# EAGLE schematic needles_2.5 (EAGLE 8.6.0)

## Sheet 1 of 2
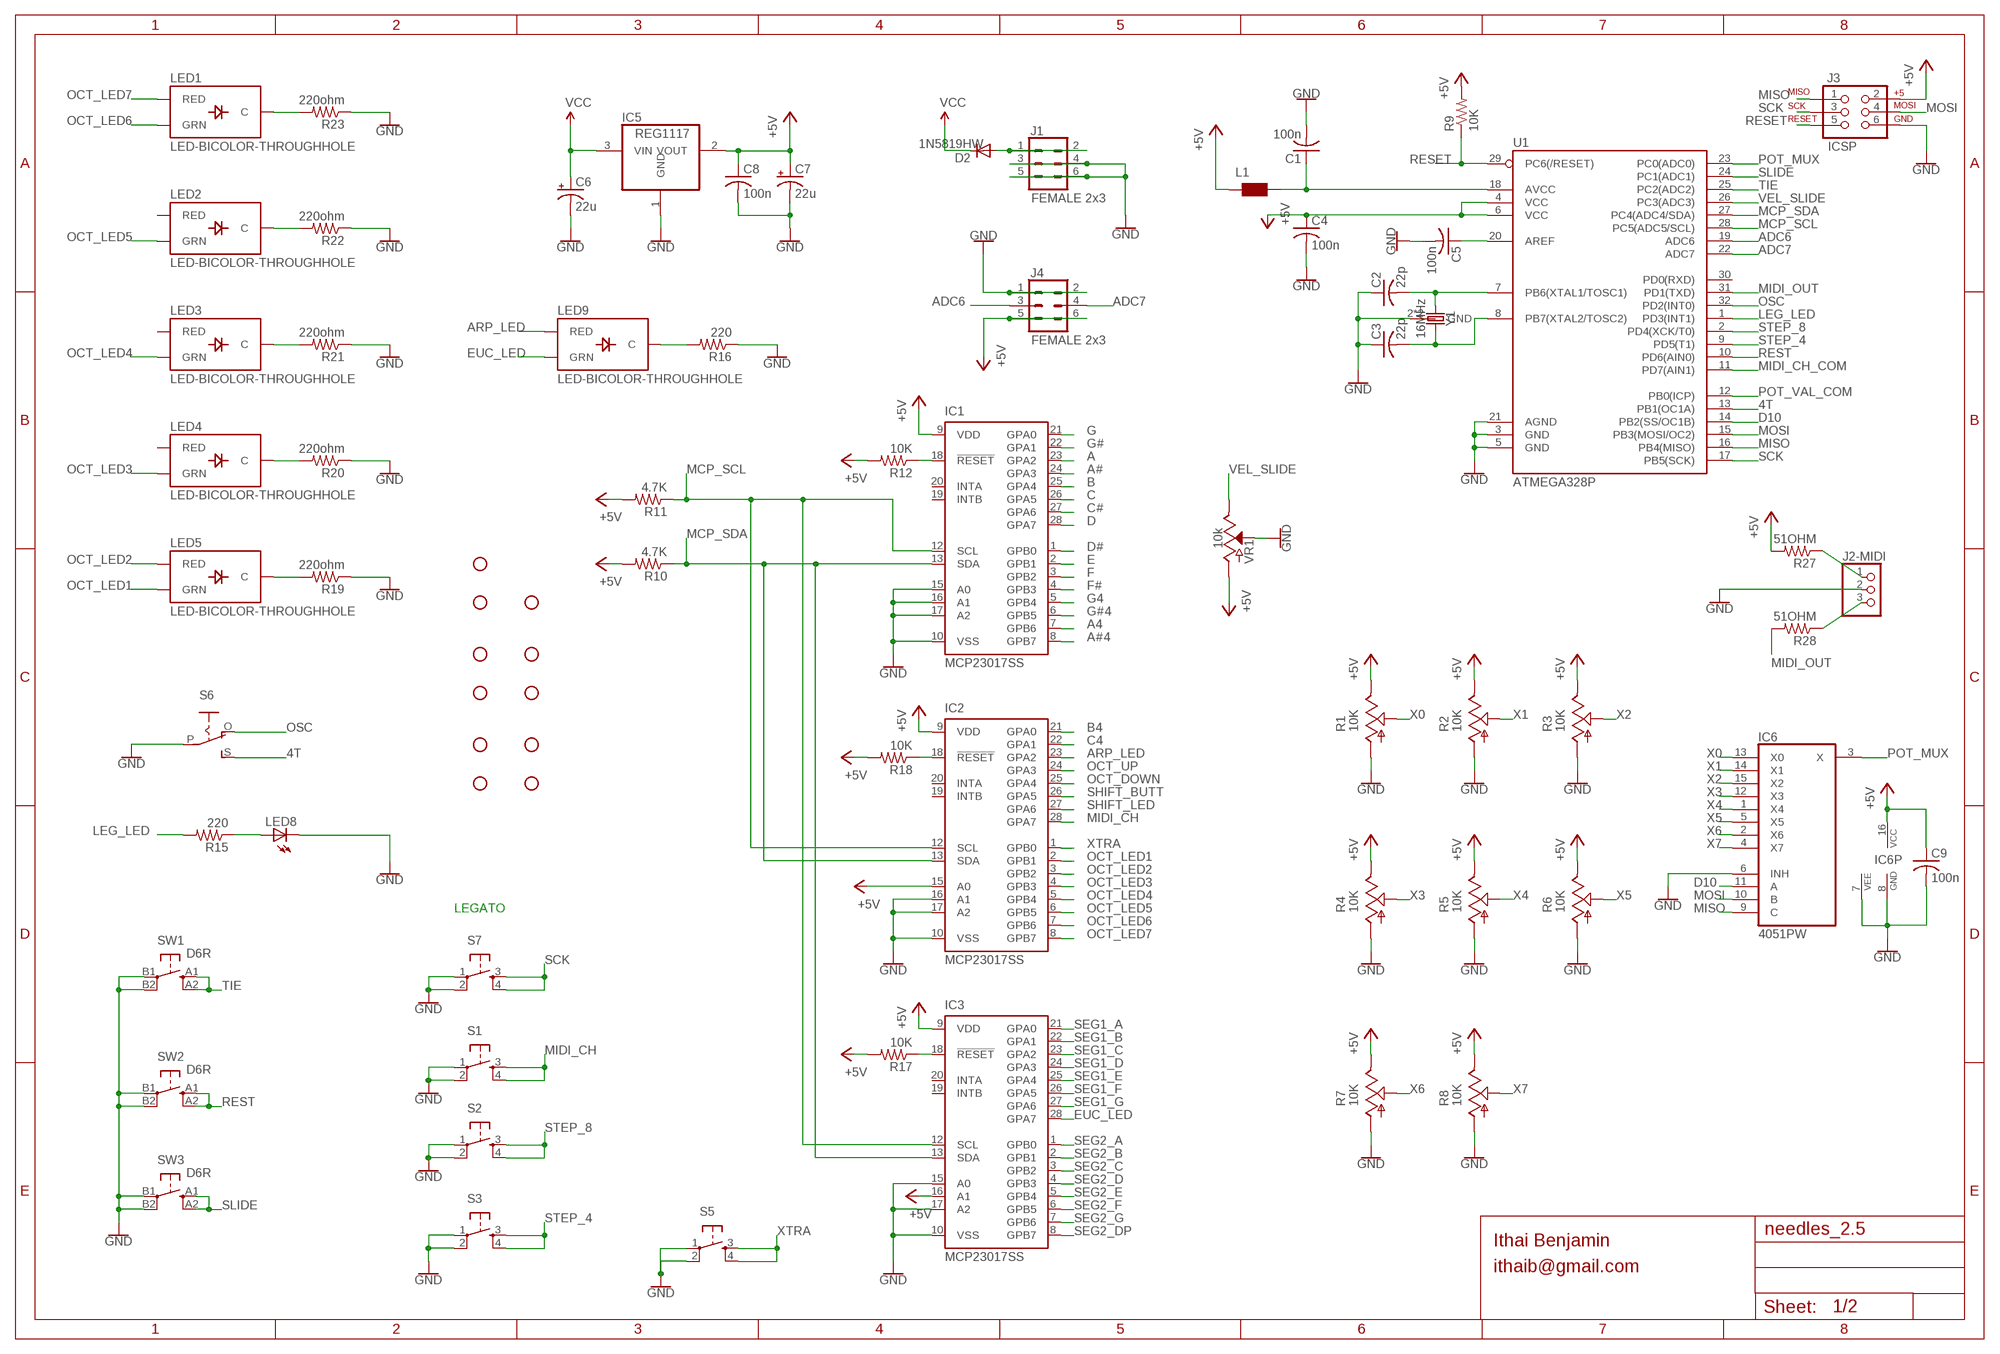
[diagram p0: schematic, sheet 1]

### Parts
C1  100n  C-USC0603  [C0603]
C2  22p  C-USC0603  [C0603]
C3  22p  C-USC0603  [C0603]
C4  100n  C-USC0603  [C0603]
C5  100n  C-USC0603  [C0603]
C6  22u  CPOL-USC  [PANASONIC_C]
C7  22u  CPOL-USC  [PANASONIC_C]
C8  100n  C-USC0603  [C0603]
C9  100n  C-USC0603  [C0603]
D2  1N5819HW  DIODE-SOD123  [SOD123]
H1  STAND-OFF  [STAND-OFF]
H2  STAND-OFF  [STAND-OFF]
H3  STAND-OFF  [STAND-OFF]
H4  STAND-OFF  [STAND-OFF]
H5  STAND-OFF  [STAND-OFF]
H6  STAND-OFF  [STAND-OFF]
H7  STAND-OFF  [STAND-OFF]
H8  STAND-OFF  [STAND-OFF]
H9  STAND-OFF  [STAND-OFF]
H10  STAND-OFF  [STAND-OFF]
H11  STAND-OFF  [STAND-OFF]
IC1  MCP23017SS  [SSOP28]
IC2  MCP23017SS  [SSOP28]
IC3  MCP23017SS  [SSOP28]
IC5  REG1117  [SOT223]
IC6  4051PW  [TSSOP16]
J1  FEMALE 2x3  CONN_03X2FEMALE  [2X3]
J2-MIDI  PINHD-1X3  [1X03]
J3  ICSP  AVR_SPI_PRG_6PTH  [2X3]
J4  FEMALE 2x3  CONN_03X2FEMALE  [2X3]
L1  WE-CBF_0603  [0603]
LED1  LED-BICOLOR-THROUGHHOLE  [LED-BICOLOR-THROUGHHOLE]
LED2  LED-BICOLOR-THROUGHHOLE  [LED-BICOLOR-THROUGHHOLE]
LED3  LED-BICOLOR-THROUGHHOLE  [LED-BICOLOR-THROUGHHOLE]
LED4  LED-BICOLOR-THROUGHHOLE  [LED-BICOLOR-THROUGHHOLE]
LED5  LED-BICOLOR-THROUGHHOLE  [LED-BICOLOR-THROUGHHOLE]
LED8  LED3MM  [LED3MM]
LED9  LED-BICOLOR-THROUGHHOLE  [LED-BICOLOR-THROUGHHOLE]
R1  10K  POT_USVERTICAL  [ALPS_POT_VERTICAL]
R2  10K  POT_USVERTICAL  [ALPS_POT_VERTICAL]
R3  10K  POT_USVERTICAL  [ALPS_POT_VERTICAL]
R4  10K  POT_USVERTICAL  [ALPS_POT_VERTICAL]
R5  10K  POT_USVERTICAL  [ALPS_POT_VERTICAL]
R6  10K  POT_USVERTICAL  [ALPS_POT_VERTICAL]
R7  10K  POT_USVERTICAL  [ALPS_POT_VERTICAL]
R8  10K  POT_USVERTICAL  [ALPS_POT_VERTICAL]
R9  10K  R-US_R0603  [R0603]
R10  4.7K  R-US_R0603  [R0603]
R11  4.7K  R-US_R0603  [R0603]
R12  10K  R-US_R0603  [R0603]
R15  220  R-US_R0603  [R0603]
R16  220  R-US_R0603  [R0603]
R17  10K  R-US_R0603  [R0603]
R18  10K  R-US_R0603  [R0603]
R19  220ohm  R-US_R0603  [R0603]
R20  220ohm  R-US_R0603  [R0603]
R21  220ohm  R-US_R0603  [R0603]
R22  220ohm  R-US_R0603  [R0603]
R23  220ohm  R-US_R0603  [R0603]
R27  51OHM  R-US_R0603  [R0603]
R28  51OHM  R-US_R0603  [R0603]
S1  TAC_SWITCHPTH  [TACTILE-PTH]
S2  TAC_SWITCHPTH  [TACTILE-PTH]
S3  TAC_SWITCHPTH  [TACTILE-PTH]
S5  TAC_SWITCHPTH  [TACTILE-PTH]
S6  S-ON-ONSMALL_SLIDE  [ES_100SP1T6B11M2QEH_SMALL]
S7  TAC_SWITCHPTH  [TACTILE-PTH]
SW1  D6R  [D6R]
SW2  D6R  [D6R]
SW3  D6R  [D6R]
U1  ATMEGA328P  ATMEGA328P_TQFP  [TQFP32-08]
VR1  10k  POTENTIOMETER_SLIDE-30MM-1/10W-20%  [SLIDER-MEDIUM]
Y1  16MHz  CRYSTAL-16MHZSMD-5X3.2  [CRYSTAL-SMD-5X3.2-4PAD]

### Nets
4T: S6.S U1.13(PB1(OC1A))
+5V: C4.1 C7.+ C8.1 C9.1 IC1.9(VDD) IC2.9(VDD) IC2.15(A0) IC3.9(VDD) IC3.16(A1) IC5.2(VOUT) IC6.16(VCC) J3.2 J4.5 J4.6 L1.1 R1.P$1(E) R2.P$1(E) R3.P$1(E) R4.P$1(E) R5.P$1(E) R6.P$1(E) R7.P$1(E) R8.P$1(E) R9.2 R10.2 R11.2 R12.2 R17.2 R18.2 R27.2 U1.4(VCC) U1.6(VCC) VR1.BOTTOM(A) ; also sheet 2
A: IC1.23(GPA2) ; also sheet 2
A4: IC1.7(GPB6) ; also sheet 2
A#: IC1.24(GPA3) ; also sheet 2
A#4: IC1.8(GPB7) ; also sheet 2
ADC6: J4.3 U1.19(ADC6)
ADC7: J4.4 U1.22(ADC7)
AREF: C5.1 U1.20(AREF)
ARP_LED: IC2.23(GPA2) LED9.3(RED)
B: IC1.25(GPA4) ; also sheet 2
B4: IC2.21(GPA0) ; also sheet 2
C: IC1.26(GPA5) ; also sheet 2
C4: IC2.22(GPA1) ; also sheet 2
C#: IC1.27(GPA6) ; also sheet 2
D: IC1.28(GPA7) ; also sheet 2
D10: IC6.11(A) U1.14(PB2(SS/OC1B))
D#: IC1.1(GPB0) ; also sheet 2
E: IC1.2(GPB1) ; also sheet 2
EUC_LED: IC3.28(GPA7) LED9.1(GRN)
F: IC1.3(GPB2) ; also sheet 2
F#: IC1.4(GPB3) ; also sheet 2
G: IC1.21(GPA0) ; also sheet 2
G4: IC1.5(GPB4) ; also sheet 2
G#: IC1.22(GPA1) ; also sheet 2
G#4: IC1.6(GPB5) ; also sheet 2
GND: C1.2 C2.1 C3.1 C4.2 C5.2 C6.- C7.- C8.2 C9.2 IC1.10(VSS) IC1.15(A0) IC1.16(A1) IC1.17(A2) IC2.10(VSS) IC2.16(A1) IC2.17(A2) IC3.10(VSS) IC3.15(A0) IC3.17(A2) IC5.1(GND) IC6.6(INH) IC6.7(VEE) IC6.8(GND) J1.3 J1.4 J1.5 J1.6 J2-MIDI.2 J3.6 J4.1 J4.2 LED8.K(C) R1.P$3(A) R2.P$3(A) R3.P$3(A) R4.P$3(A) R5.P$3(A) R6.P$3(A) R7.P$3(A) R8.P$3(A) R16.1 R19.1 R20.1 R21.1 R22.1 R23.1 S1.1 S1.2 S2.1 S2.2 S3.1 S3.2 S5.1 S5.2 S6.P S7.1 S7.2 SW1.B1(P) SW1.B2(P1) SW2.B1(P) SW2.B2(P1) SW3.B1(P) SW3.B2(P1) U1.3(GND) U1.5(GND) U1.21(AGND) VR1.WIPER(S) Y1.2(GND) Y1.4(GND) ; also sheet 2
LEG_LED: R15.2 U1.1(PD3(INT1))
MCP_SCL: IC1.12(SCL) IC2.12(SCL) IC3.12(SCL) R11.1 U1.28(PC5(ADC5/SCL))
MCP_SDA: IC1.13(SDA) IC2.13(SDA) IC3.13(SDA) R10.1 U1.27(PC4(ADC4/SDA))
MIDI_CH: IC2.28(GPA7) S1.3 S1.4
MIDI_CH_COM: U1.11(PD7(AIN1)) ; also sheet 2
MIDI_OUT: R28.2 U1.31(PD1(TXD))
MISO: IC6.9(C) J3.1 U1.16(PB4(MISO))
MOSI: IC6.10(B) J3.4 U1.15(PB3(MOSI/OC2))
N$1: IC1.18(!RESET) R12.1
N$2: IC2.18(!RESET) R18.1
N$3: C1.1 L1.2 U1.18(AVCC)
N$4: LED1.2(C) R23.2
N$5: C2.2 U1.7(PB6(XTAL1/TOSC1)) Y1.1
N$6: C3.2 U1.8(PB7(XTAL2/TOSC2)) Y1.3
N$7: LED2.2(C) R22.2
N$8: IC3.18(!RESET) R17.1
N$9: LED3.2(C) R21.2
N$10: LED4.2(C) R20.2
N$11: LED5.2(C) R19.2
N$13: J2-MIDI.1 R27.1
N$18: J2-MIDI.3 R28.1
N$21: LED8.A R15.1
N$23: LED9.2(C) R16.2
N$42: D2.A J1.1 J1.2
OCT_DOWN: IC2.25(GPA4) ; also sheet 2
OCT_LED1: IC2.2(GPB1) LED5.1(GRN)
OCT_LED2: IC2.3(GPB2) LED5.3(RED)
OCT_LED3: IC2.4(GPB3) LED4.1(GRN)
OCT_LED4: IC2.5(GPB4) LED3.1(GRN)
OCT_LED5: IC2.6(GPB5) LED2.1(GRN)
OCT_LED6: IC2.7(GPB6) LED1.1(GRN)
OCT_LED7: IC2.8(GPB7) LED1.3(RED)
OCT_UP: IC2.24(GPA3) ; also sheet 2
OSC: S6.O U1.32(PD2(INT0))
POT_MUX: IC6.3(X) U1.23(PC0(ADC0))
POT_VAL_COM: U1.12(PB0(ICP)) ; also sheet 2
RESET: J3.5 R9.1 U1.29(PC6(/RESET))
REST: SW2.A1(S) SW2.A2(S1) U1.10(PD6(AIN0))
SCK: J3.3 S7.3 S7.4 U1.17(PB5(SCK))
SEG1_A: IC3.21(GPA0) ; also sheet 2
SEG1_B: IC3.22(GPA1) ; also sheet 2
SEG1_C: IC3.23(GPA2) ; also sheet 2
SEG1_D: IC3.24(GPA3) ; also sheet 2
SEG1_E: IC3.25(GPA4) ; also sheet 2
SEG1_F: IC3.26(GPA5) ; also sheet 2
SEG1_G: IC3.27(GPA6) ; also sheet 2
SEG2_A: IC3.1(GPB0) ; also sheet 2
SEG2_B: IC3.2(GPB1) ; also sheet 2
SEG2_C: IC3.3(GPB2) ; also sheet 2
SEG2_D: IC3.4(GPB3) ; also sheet 2
SEG2_DP: IC3.8(GPB7) ; also sheet 2
SEG2_E: IC3.5(GPB4) ; also sheet 2
SEG2_F: IC3.6(GPB5) ; also sheet 2
SEG2_G: IC3.7(GPB6) ; also sheet 2
SHIFT_BUTT: IC2.26(GPA5) ; also sheet 2
SHIFT_LED: IC2.27(GPA6) ; also sheet 2
SLIDE: SW3.A1(S) SW3.A2(S1) U1.24(PC1(ADC1))
STEP_4: S3.3 S3.4 U1.9(PD5(T1))
STEP_8: S2.3 S2.4 U1.2(PD4(XCK/T0))
TIE: SW1.A1(S) SW1.A2(S1) U1.25(PC2(ADC2))
VCC: C6.+ D2.C IC5.3(VIN)
VEL_SLIDE: U1.26(PC3(ADC3)) VR1.TOP(E)
X0: IC6.13(X0) R1.P$2(S)
X1: IC6.14(X1) R2.P$2(S)
X2: IC6.15(X2) R3.P$2(S)
X3: IC6.12(X3) R4.P$2(S)
X4: IC6.1(X4) R5.P$2(S)
X5: IC6.5(X5) R6.P$2(S)
X6: IC6.2(X6) R7.P$2(S)
X7: IC6.4(X7) R8.P$2(S)
XTRA: IC2.1(GPB0) S5.3 S5.4
Unconnected: IC1.19(INTB) IC1.20(INTA) IC2.19(INTB) IC2.20(INTA) IC3.19(INTB) IC3.20(INTA) LED2.3(RED) LED3.3(RED) LED4.3(RED) U1.30(PD0(RXD))

### Notes on the sheet
- LEGATO
- Ithai Benjamin
- ithaib@gmail.com

## Sheet 2 of 2
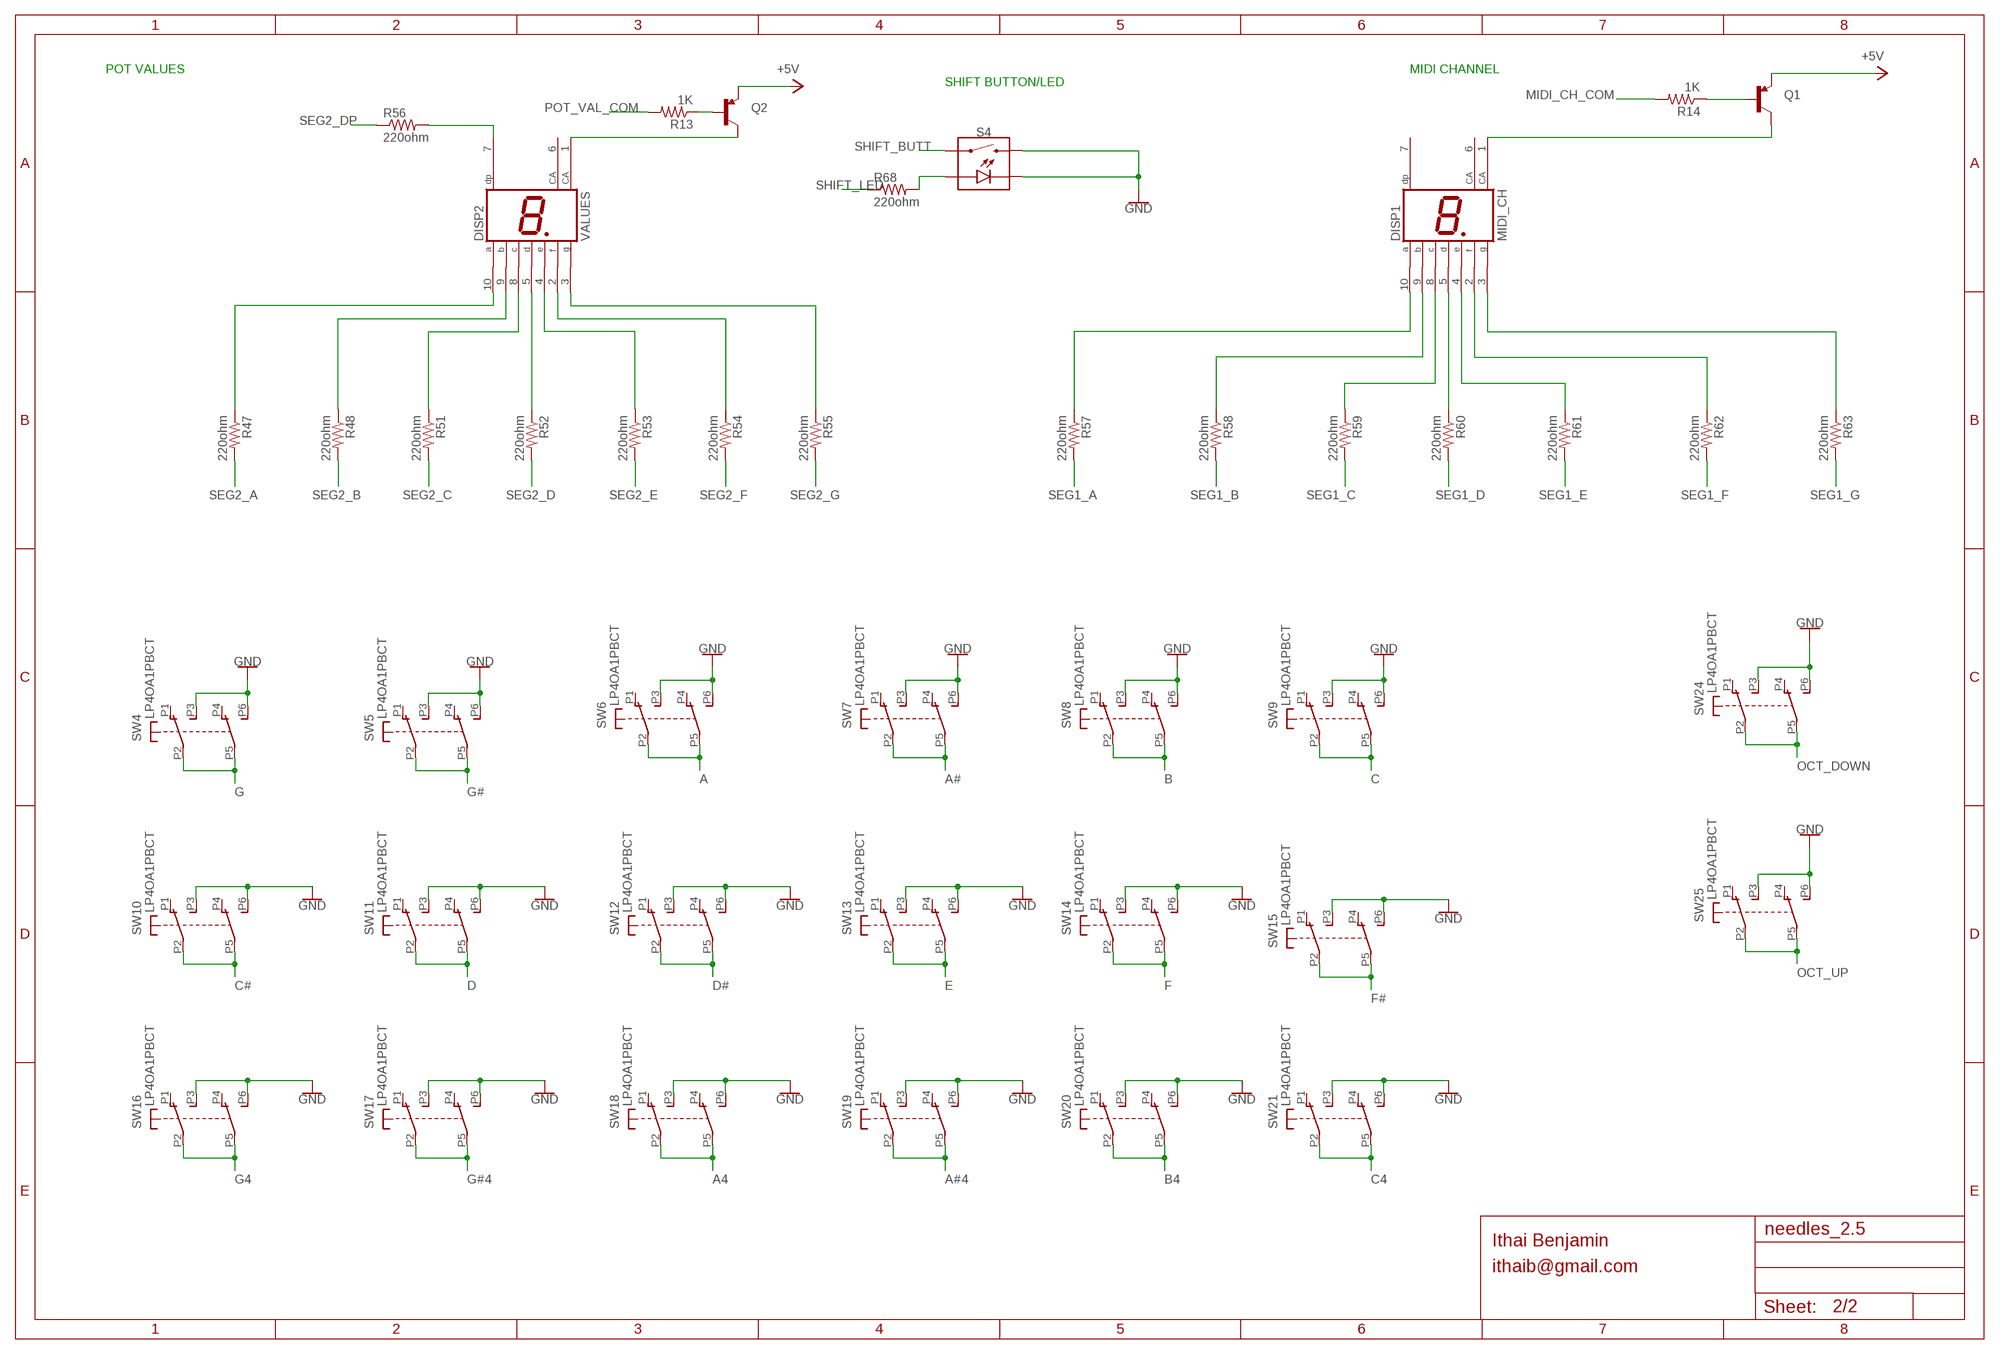
[diagram p1: schematic, sheet 2]

### Parts
DISP1  MIDI_CH  DISPLAY-HP_HD-F101  [DISPLAY-HP_HDSP-E]
DISP2  VALUES  DISPLAY-HP_HD-F101  [DISPLAY-HP_HDSP-E]
Q1  TRANSISTOR_PNPSMD  [SOT23-3]
Q2  TRANSISTOR_PNPSMD  [SOT23-3]
R13  1K  R-US_R0603  [R0603]
R14  1K  R-US_R0603  [R0603]
R47  220ohm  R-US_R0603  [R0603]
R48  220ohm  R-US_R0603  [R0603]
R51  220ohm  R-US_R0603  [R0603]
R52  220ohm  R-US_R0603  [R0603]
R53  220ohm  R-US_R0603  [R0603]
R54  220ohm  R-US_R0603  [R0603]
R55  220ohm  R-US_R0603  [R0603]
R56  220ohm  R-US_R0603  [R0603]
R57  220ohm  R-US_R0603  [R0603]
R58  220ohm  R-US_R0603  [R0603]
R59  220ohm  R-US_R0603  [R0603]
R60  220ohm  R-US_R0603  [R0603]
R61  220ohm  R-US_R0603  [R0603]
R62  220ohm  R-US_R0603  [R0603]
R63  220ohm  R-US_R0603  [R0603]
R68  220ohm  R-US_R0603  [R0603]
S4  MOMENTARY-SWITCH-SPST-LED-PTH-12MM  [TACTILE_SWITCH_LED_PTH_12MM]
SW4  LP4OA1PBCT  [LP4OA1PBCT]
SW5  LP4OA1PBCT  [LP4OA1PBCT]
SW6  LP4OA1PBCT  [LP4OA1PBCT]
SW7  LP4OA1PBCT  [LP4OA1PBCT]
SW8  LP4OA1PBCT  [LP4OA1PBCT]
SW9  LP4OA1PBCT  [LP4OA1PBCT]
SW10  LP4OA1PBCT  [LP4OA1PBCT]
SW11  LP4OA1PBCT  [LP4OA1PBCT]
SW12  LP4OA1PBCT  [LP4OA1PBCT]
SW13  LP4OA1PBCT  [LP4OA1PBCT]
SW14  LP4OA1PBCT  [LP4OA1PBCT]
SW15  LP4OA1PBCT  [LP4OA1PBCT]
SW16  LP4OA1PBCT  [LP4OA1PBCT]
SW17  LP4OA1PBCT  [LP4OA1PBCT]
SW18  LP4OA1PBCT  [LP4OA1PBCT]
SW19  LP4OA1PBCT  [LP4OA1PBCT]
SW20  LP4OA1PBCT  [LP4OA1PBCT]
SW21  LP4OA1PBCT  [LP4OA1PBCT]
SW24  LP4OA1PBCT  [LP4OA1PBCT]
SW25  LP4OA1PBCT  [LP4OA1PBCT]

### Nets
+5V: Q1.2(E) Q2.2(E) ; also sheet 1
A: SW6.P2(A2) SW6.P5(B2) ; also sheet 1
A4: SW18.P2(A2) SW18.P5(B2) ; also sheet 1
A#: SW7.P2(A2) SW7.P5(B2) ; also sheet 1
A#4: SW19.P2(A2) SW19.P5(B2) ; also sheet 1
B: SW8.P2(A2) SW8.P5(B2) ; also sheet 1
B4: SW20.P2(A2) SW20.P5(B2) ; also sheet 1
C: SW9.P2(A2) SW9.P5(B2) ; also sheet 1
C4: SW21.P2(A2) SW21.P5(B2) ; also sheet 1
C#: SW10.P2(A2) SW10.P5(B2) ; also sheet 1
D: SW11.P2(A2) SW11.P5(B2) ; also sheet 1
D#: SW12.P2(A2) SW12.P5(B2) ; also sheet 1
E: SW13.P2(A2) SW13.P5(B2) ; also sheet 1
F: SW14.P2(A2) SW14.P5(B2) ; also sheet 1
F#: SW15.P2(A2) SW15.P5(B2) ; also sheet 1
G: SW4.P2(A2) SW4.P5(B2) ; also sheet 1
G4: SW16.P2(A2) SW16.P5(B2) ; also sheet 1
G#: SW5.P2(A2) SW5.P5(B2) ; also sheet 1
G#4: SW17.P2(A2) SW17.P5(B2) ; also sheet 1
GND: S4.1 S4.2 S4.C SW4.P3(A3) SW4.P6(B3) SW5.P3(A3) SW5.P6(B3) SW6.P3(A3) SW6.P6(B3) SW7.P3(A3) SW7.P6(B3) SW8.P3(A3) SW8.P6(B3) SW9.P3(A3) SW9.P6(B3) SW10.P3(A3) SW10.P6(B3) SW11.P3(A3) SW11.P6(B3) SW12.P3(A3) SW12.P6(B3) SW13.P3(A3) SW13.P6(B3) SW14.P3(A3) SW14.P6(B3) SW15.P3(A3) SW15.P6(B3) SW16.P3(A3) SW16.P6(B3) SW17.P3(A3) SW17.P6(B3) SW18.P3(A3) SW18.P6(B3) SW19.P3(A3) SW19.P6(B3) SW20.P3(A3) SW20.P6(B3) SW21.P3(A3) SW21.P6(B3) SW24.P3(A3) SW24.P6(B3) SW25.P3(A3) SW25.P6(B3) ; also sheet 1
MIDI_CH_COM: R14.2 ; also sheet 1
N$12: R68.2 S4.A
N$17: Q1.1(B) R14.1
N$20: Q2.1(B) R13.1
N$22: DISP2.1(CA) Q2.3(C)
N$29: DISP2.10(A) R47.1
N$30: DISP2.9(B) R48.1
N$31: DISP2.8(C) R51.1
N$32: DISP2.5(D) R52.1
N$33: DISP2.4(E) R53.1
N$34: DISP2.2(F) R54.1
N$35: DISP2.3(G) R55.1
N$36: DISP1.10(A) R57.1
N$37: DISP2.7(DP) R56.2
N$38: DISP1.1(CA) Q1.3(C)
N$39: DISP1.9(B) R58.1
N$40: DISP1.8(C) R59.1
N$41: DISP1.5(D) R60.1
N$43: DISP1.4(E) R61.1
N$44: DISP1.2(F) R62.1
N$45: DISP1.3(G) R63.1
OCT_DOWN: SW24.P2(A2) SW24.P5(B2) ; also sheet 1
OCT_UP: SW25.P2(A2) SW25.P5(B2) ; also sheet 1
POT_VAL_COM: R13.2 ; also sheet 1
SEG1_A: R57.2 ; also sheet 1
SEG1_B: R58.2 ; also sheet 1
SEG1_C: R59.2 ; also sheet 1
SEG1_D: R60.2 ; also sheet 1
SEG1_E: R61.2 ; also sheet 1
SEG1_F: R62.2 ; also sheet 1
SEG1_G: R63.2 ; also sheet 1
SEG2_A: R47.2 ; also sheet 1
SEG2_B: R48.2 ; also sheet 1
SEG2_C: R51.2 ; also sheet 1
SEG2_D: R52.2 ; also sheet 1
SEG2_DP: R56.1 ; also sheet 1
SEG2_E: R53.2 ; also sheet 1
SEG2_F: R54.2 ; also sheet 1
SEG2_G: R55.2 ; also sheet 1
SHIFT_BUTT: S4.3 S4.4 ; also sheet 1
SHIFT_LED: R68.1 ; also sheet 1
Unconnected: DISP1.6(CA) DISP1.7(DP) DISP2.6(CA) SW4.P1(A1) SW4.P4(B1) SW5.P1(A1) SW5.P4(B1) SW6.P1(A1) SW6.P4(B1) SW7.P1(A1) SW7.P4(B1) SW8.P1(A1) SW8.P4(B1) SW9.P1(A1) SW9.P4(B1) SW10.P1(A1) SW10.P4(B1) SW11.P1(A1) SW11.P4(B1) SW12.P1(A1) SW12.P4(B1) SW13.P1(A1) SW13.P4(B1) SW14.P1(A1) SW14.P4(B1) SW15.P1(A1) SW15.P4(B1) SW16.P1(A1) SW16.P4(B1) SW17.P1(A1) SW17.P4(B1) SW18.P1(A1) SW18.P4(B1) SW19.P1(A1) SW19.P4(B1) SW20.P1(A1) SW20.P4(B1) SW21.P1(A1) SW21.P4(B1) SW24.P1(A1) SW24.P4(B1) SW25.P1(A1) SW25.P4(B1)

### Notes on the sheet
- POT VALUES | MIDI CHANNEL
- SHIFT BUTTON/LED
- Ithai Benjamin
- ithaib@gmail.com

## Library data of the parts
C1-C5 C8 C9 = grids_v02:C-US: CAPACITOR, American symbol
C6 C7 = grids_v02:CPOL-US: POLARIZED CAPACITOR, American symbol
D2 = grids_v02:DIODE-: DIODE
DISP1 DISP2 = Benjamin_Controller_V2.1:DISPLAY-HP_HD-F101: LED DISPLAY 1-character 7 segment, decimal point right; OC_FARNELL: unknown; OC_NEWARK: unknown
H1-H11 = SparkFun-Hardware:STAND-OFF: Stand Off Drill holes for mechanically mounting via screws, standoffs, etc. Note: Use the keepout ring to avoid running the screw head into surrounding components. Variant Overviews STAND-OFF - Mechanical footprint for a #4 phillips button head screw. STAND-OFF-TIGHT - Mechanical footprint for a #4 phillips button head screw, Example SparkFun Products Screw - Phillips Head (1/4", 4-40, 10 pack) <https://www.sparkfun.com/products/10453> (PRT-10453) Screw - Phillips Head (1/2", 4-40, 10 pack) <https://www.sparkfun.com/products/10452> (PRT-10452) Screw - Phillips Head (3/4", 4-40, 10 pack) <https://www.sparkfun.com/products/10451> (PRT-10451) Screw - Phillips Head (1", 4-40, 10 pack) <https://www.sparkfun.com/products/10450> (PRT-10450)
IC1-IC3 = adafruit:MCP23017: http://ww1.microchip.com/downloads/en/DeviceDoc/21952a.pdf Source: http://ww1.microchip.com/downloads/en/DeviceDoc/21952a.pdf
IC5 = grids_v02:REG1117: 800mA and 1A Low Dropout (LDO) Positive Regulator 1.8V, 2.5V, 2.85V, 3.3V, 5V, and Adj
IC6 = elements_v02:4051: 8-channel ANALOG MULTIPLEXER
J1 J4 = SparkFun-Connectors:CONN_03X2: Multi connection point. Often used as Generic Header-pin footprint for 0.1 inch spaced/style header connections You can populate with any combo of single row headers, but if you'd like an exact match, check these: Header - 2x3 (Male, 0.1") <https://www.sparkfun.com/products/12807> (PRT-12807) Header - 2x3 (Female, 0.1") <https://www.sparkfun.com/products/13010> (PRT-13010) 2x3 Pin Shrouded Header <https://www.sparkfun.com/products/10877> (PRT-10877) On any of the 0.1 inch spaced packages, you can populate with these: Break Away Headers - Straight <https://www.sparkfun.com/products/116> (PRT-00116) Break Away Male Headers - Right Angle <https://www.sparkfun.com/products/553> (PRT-00553) Female Headers <https://www.sparkfun.com/products/115> (PRT-00115) Break Away Headers - Machine Pin <https://www.sparkfun.com/products/117> (PRT-00117) Break Away Female Headers - Swiss Machine Pin <https://www.sparkfun.com/products/743> (PRT-00743) Special note: the shrouded connector mates well with our 3x2 ribbon cables: Ribbon Crimp Connector - 6-pin (2x3, Female) <https://www.sparkfun.com/products/10651> (PRT-10651) Ribbon Cable - 6 wire (15ft) <https://www.sparkfun.com/products/10646> (PRT-10646); PROD_ID: CONN-11566
J2-MIDI = adafruit:PINHD-1X3: PIN HEADER
J3 = grids_v02:AVR_SPI_PRG_6: AVR ISP 6 Pin This is the reduced ISP connector for AVR programming. Common on Arduino. This footprint will take up less PCB space and can be used with a 10-pin to 6-pin adapter such as SKU: BOB-08508
L1 = grids_v02:WE-CBF: SMD EMI Suppression Ferrite Beads - excellent anti-EMI properties - low DCR - impedances till 3000 ohms - rated current up to 6 A
LED1-LED5 LED9 = rings_v30:LED-BICOLOR-THROUGHHOLE
LED8 = grids_v02:LED: LED OSRAM: - CHIPLED LG R971, LG N971, LY N971, LG Q971, LY Q971, LO R971, LY R971 LH N974, LH R974 LS Q976, LO Q976, LY Q976 LO Q996 - Hyper CHIPLED LW Q18S LB Q993, LB Q99A, LB R99A - SideLED LS A670, LO A670, LY A670, LG A670, LP A670 LB A673, LV A673, LT A673, LW A673 LH A674 LY A675 LS A676, LA A676, LO A676, LY A676, LW A676 LS A679, LY A679, LG A679 - Hyper Micro SIDELED® LS Y876, LA Y876, LO Y876, LY Y876 LT Y87S - SmartLED LW L88C, LW L88S LB L89C, LB L89S, LG L890 LS L89K, LO L89K, LY L89K LS L896, LA L896, LO L896, LY L896 - TOPLED LS T670, LO T670, LY T670, LG T670, LP T670 LSG T670, LSP T670, LSY T670, LOP T670, LYG T670 LG T671, LOG T671, LSG T671 LB T673, LV T673, LT T673, LW T673 LH T674 LS T676, LA T676, LO T676, LY T676, LB T676, LH T676, LSB T676, LW T676 LB T67C, LV T67C, LT T67C, LS T67K, LO T67K, LY T67K, LW E67C LS E67B, LA E67B, LO E67B, LY E67B, LB E67C, LV E67C, LT E67C LW T67C LS T679, LY T679, LG T679 LS T770, LO T770, LY T770, LG T770, LP T770 LB T773, LV T773, LT T773, LW T773 LH T774 LS E675, LA E675, LY E675, LS T675 LS T776, LA T776, LO T776, LY T776, LB T776 LHGB T686 LT T68C, LB T68C - Hyper Mini TOPLED® LB M676 - Mini TOPLED Santana® LG M470 LS M47K, LO M47K, LY M47K Source: http://www.osram.convergy.de LUXEON: - LUMILED® LXK2-PW12-R00, LXK2-PW12-S00, LXK2-PW14-U00, LXK2-PW14-V00 LXK2-PM12-R00, LXK2-PM12-S00, LXK2-PM14-U00 LXK2-PE12-Q00, LXK2-PE12-R00, LXK2-PE12-S00, LXK2-PE14-T00, LXK2-PE14-U00 LXK2-PB12-K00, LXK2-PB12-L00, LXK2-PB12-M00, LXK2-PB14-N00, LXK2-PB14-P00, LXK2-PB14-Q00 LXK2-PR12-L00, LXK2-PR12-M00, LXK2-PR14-Q00, LXK2-PR14-R00 LXK2-PD12-Q00, LXK2-PD12-R00, LXK2-PD12-S00 LXK2-PH12-R00, LXK2-PH12-S00 LXK2-PL12-P00, LXK2-PL12-Q00, LXK2-PL12-R00 Source: www.luxeon.com KINGBRIGHT: KA-3528ASYC Source: www.kingbright.com
Q1 Q2 = User-Submitted:TRANSISTOR_PNP: Generic PNP BJT Double check pinouts against datasheets- not all devices are the same! MMBT3906 - 40V 200mA SOT-23 (TRANS-08052) MMBT4403 - 40V 600mA SOT-23 (TRANS-09245)
R1-R8 = rings_v30:POT_US
R9-R23 R27 R28 R47 R48 R51-R63 R68 = grids_v02:R-US_: RESISTOR, American symbol
S1-S3 S5 S7 = rings_v30:TAC_SWITCH: Momentary Switch Button commonly used for reset or general input. Spark Fun Electronics SKU : COM-00097
S4 = SparkFun-Switches:MOMENTARY-SWITCH-SPST-LED: Momentary Switch (Pushbutton) - SPST - w/ LED Normally-open (NO) SPST momentary switches (buttons, pushbuttons), with a built-in LED. Variants PTH-CHERRY - Cherry MX Switch Cherry MX Keyswitches are top-of-the-line mechanical keyboard switches. They’re satisfyingly “clicky”, reliable up to tens-of-millions of key presses, and a standard in gaming and programming keyboards across the globe. This ‘blue’ version Cherry MX Switch is favored by most due to its secondary internal actuator making it less likely to “double-tap.” If you are looking for a noticeably audible and high-quality key switch, this is the perfect option for you! Cherry MX Switch <https://www.sparkfun.com/products/13834> (COM-13834) Cherry MX Switch Breakout <https://www.sparkfun.com/products/13773> (BOB-13773) PTH-12MM and PTH-12MM-KIT - 12mm Illuminated LED KIT variant is for soldering kits. There is no tStop (covering up the top side of the pads with mask). This helps the beginner see which side they should be soldering too. LED Tactile Button Breakout <https://www.sparkfun.com/products/10467> (BOB-10467) LED Tactile Button - Red <https://www.sparkfun.com/products/10442> (COM-10442) LED Tactile Button - Blue <https://www.sparkfun.com/products/10443> (COM-10443) LED Tactile Button - Green <https://www.sparkfun.com/products/10440> (COM-10440) LED Tactile Button - Orange <https://www.sparkfun.com/products/10441> (COM-10441) LED Tactile Button - White <https://www.sparkfun.com/products/10439> (COM-10439); PROD_ID: SWCH-11758; SF_SKU: COM-10442
S6 = shades_v30:S-ON-ON: On-on Switch
SW1-SW3 = yarns_v03:D6R: C&K D6R
SW4-SW21 = grids_v02:LP4OA1PBCT
SW24 SW25 = Grids_copy:LP4OA1PBCT
U1 = SparkFun-IC-Microcontroller:ATMEGA328P_TQFP: Popular 328P in QFP Storefront component: ATmega328 - TQFP <https://www.sparkfun.com/products/13448> (COM-13448) Datasheet <http://www.sparkfun.com/datasheets/Components/SMD/ATMega328.pdf> SparkFun Products SparkFun RedBoard - Programmed with Arduino <https://www.sparkfun.com/products/12757> (DEV-12757) Arduino Pro Mini 328 - 5V/16MHz <https://www.sparkfun.com/products/11113> (DEV-11113) Arduino Pro Mini 328 - 3.3V/8MHz <https://www.sparkfun.com/products/11114> (DEV-11114) SparkFun OpenLog <https://www.sparkfun.com/products/13712> (DEV-13712) SparkFun MicroView - OLED Arduino Module <https://www.sparkfun.com/products/12923> (DEV-12923) SparkFun Digital Sandbox <https://www.sparkfun.com/products/12651> (DEV-12651) SparkFun PicoBoard <https://www.sparkfun.com/products/11888> (WIG-11888) Arduino Fio <https://www.sparkfun.com/products/10116> (DEV-10116) LilyPad Arduino 328 Main Board <https://www.sparkfun.com/products/13342> (DEV-13342) SparkFun RedStick <https://www.sparkfun.com/products/13741> (DEV-13741) LilyPad MP3 <https://www.sparkfun.com/products/11013> (DEV-11013) LilyPad Arduino SimpleSnap <https://www.sparkfun.com/products/10941> (DEV-10941) SparkFun Stepoko <https://www.sparkfun.com/products/13899> (ROB-13899) SparkFun Geiger Counter <https://www.sparkfun.com/products/11345> (SEN-11345) SparkFun EL Sequencer <https://www.sparkfun.com/products/12781> (COM-12781) Arduino Pro 328 - 5V/16MHz <https://www.sparkfun.com/products/10915> (DEV-10915) CryptoCape <https://www.sparkfun.com/products/12773> (DEV-12773) SparkFun IR Thermometer Evaluation Board - MLX90614 <https://www.sparkfun.com/products/10740> (SEN-10740) SparkFun RedBot Mainboard <https://www.sparkfun.com/products/12097> (ROB-12097) Arduino Pro 328 - 3.3V/8MHz <https://www.sparkfun.com/products/10914> (DEV-10914) SparkFun Block for Intel® Edison - Arduino <https://www.sparkfun.com/products/13036> (DEV-13036) SparkFun Simon Says - Surface Mount Soldering Kit <https://www.sparkfun.com/products/10935> (KIT-10935) SparkFun 7-Segment Serial Display - Red <https://www.sparkfun.com/products/11441> (COM-11441) SparkFun 7-Segment Serial Display - White <https://www.sparkfun.com/products/11629> (COM-11629) SparkFun 7-Segment Serial Display - Yellow <https://www.sparkfun.com/products/11443> (COM-11443) SparkFun 7-Segment Serial Display - Kelly Green <https://www.sparkfun.com/products/11440> (COM-11440) SparkFun 7-Segment Serial Display - Blue <https://www.sparkfun.com/products/11442> (COM-11442) SparkFun OpenSegment Serial Display - 20mm (Blue) <https://www.sparkfun.com/products/11647> (COM-11647) SparkFun OpenSegment Serial Display - 20mm (Green) <https://www.sparkfun.com/products/11646> (COM-11646) SparkFun OpenSegment Serial Display - 20mm (White) <https://www.sparkfun.com/products/11648> (COM-11648) SparkFun OpenSegment Serial Display - 20mm (Red) <https://www.sparkfun.com/products/11644> (COM-11644) SparkFun OpenSegment Serial Display - 20mm (Yellow) <https://www.sparkfun.com/products/11645> (COM-11645) SparkFun OpenSegment Shield <https://www.sparkfun.com/products/13190> (DEV-13190); PROD_ID: IC-09069; VALUE: ATMEGA328P_TQFP
VR1 = SparkFun-Resistors:POTENTIOMETER_SLIDE: Slide Potentiometer Slide-type potentiometers - pots that are adjusted by sliding a wiper up or down. Commonly found en-masse on sound boards. Variants 60MM - Slide Pot - X-Large (10k Linear Taper) <https://www.sparkfun.com/products/9119> (COM-09119) 10k linear slide pot with 60mm travel. Datasheet <http://cdn.sparkfun.com/datasheets/Components/Switches/SC608N-b10k.pdf> 30MM, 30MM-KIT - Slide Pot - Medium (10k Linear Taper) <https://www.sparkfun.com/products/11621> (COM-11621) 10k linear slide pot with 30mm travel. Datasheet <http://cdn.sparkfun.com/datasheets/Components/Switches/C-31-.pdf> (C3031N-1A2-B10K-GP) "KIT" variant, intended for soldering kits, has tStop removed from pads so the component can only be stuffed on one side of the board. 20MM - Slide Pot - Small (10k Linear Taper) <https://www.sparkfun.com/products/11620> (COM-11620) 10k linear slide pot with 20mm travel. Datasheet <http://cdn.sparkfun.com/datasheets/Components/Switches/C-31-.pdf> (C2031N-1A2-B10K-GP); PROD_ID: RES-11931; SF_SKU: COM-11621
Y1 = SparkFun-Clocks:CRYSTAL-16MHZ: 16MHz Crystal Digikey Example <http://www.digikey.com/product-search/en?keywords=535-9122-1-ND> Frequency: 16MHz Frequency Stability: ±50ppm Frequency Tolerance: ±20ppm Load Capacitance: 18pF SparkFun Products: Pro Micro -5V/16MHz <https://www.sparkfun.com/products/12640> SparkFun Serial Enabled LCD Kit <https://www.sparkfun.com/products/10097>; PROD_ID: XTAL-08218; SF_ID: COM-00094